# EasyEDA schematic EasyEDA SCHEMATIC.json
TITLE: ESCC Interceptor - first schematic; REV: 0.1; Date: 2024-01-13; Sheet: 1/1; Drawn By: devtekve; Company: sunnypilot
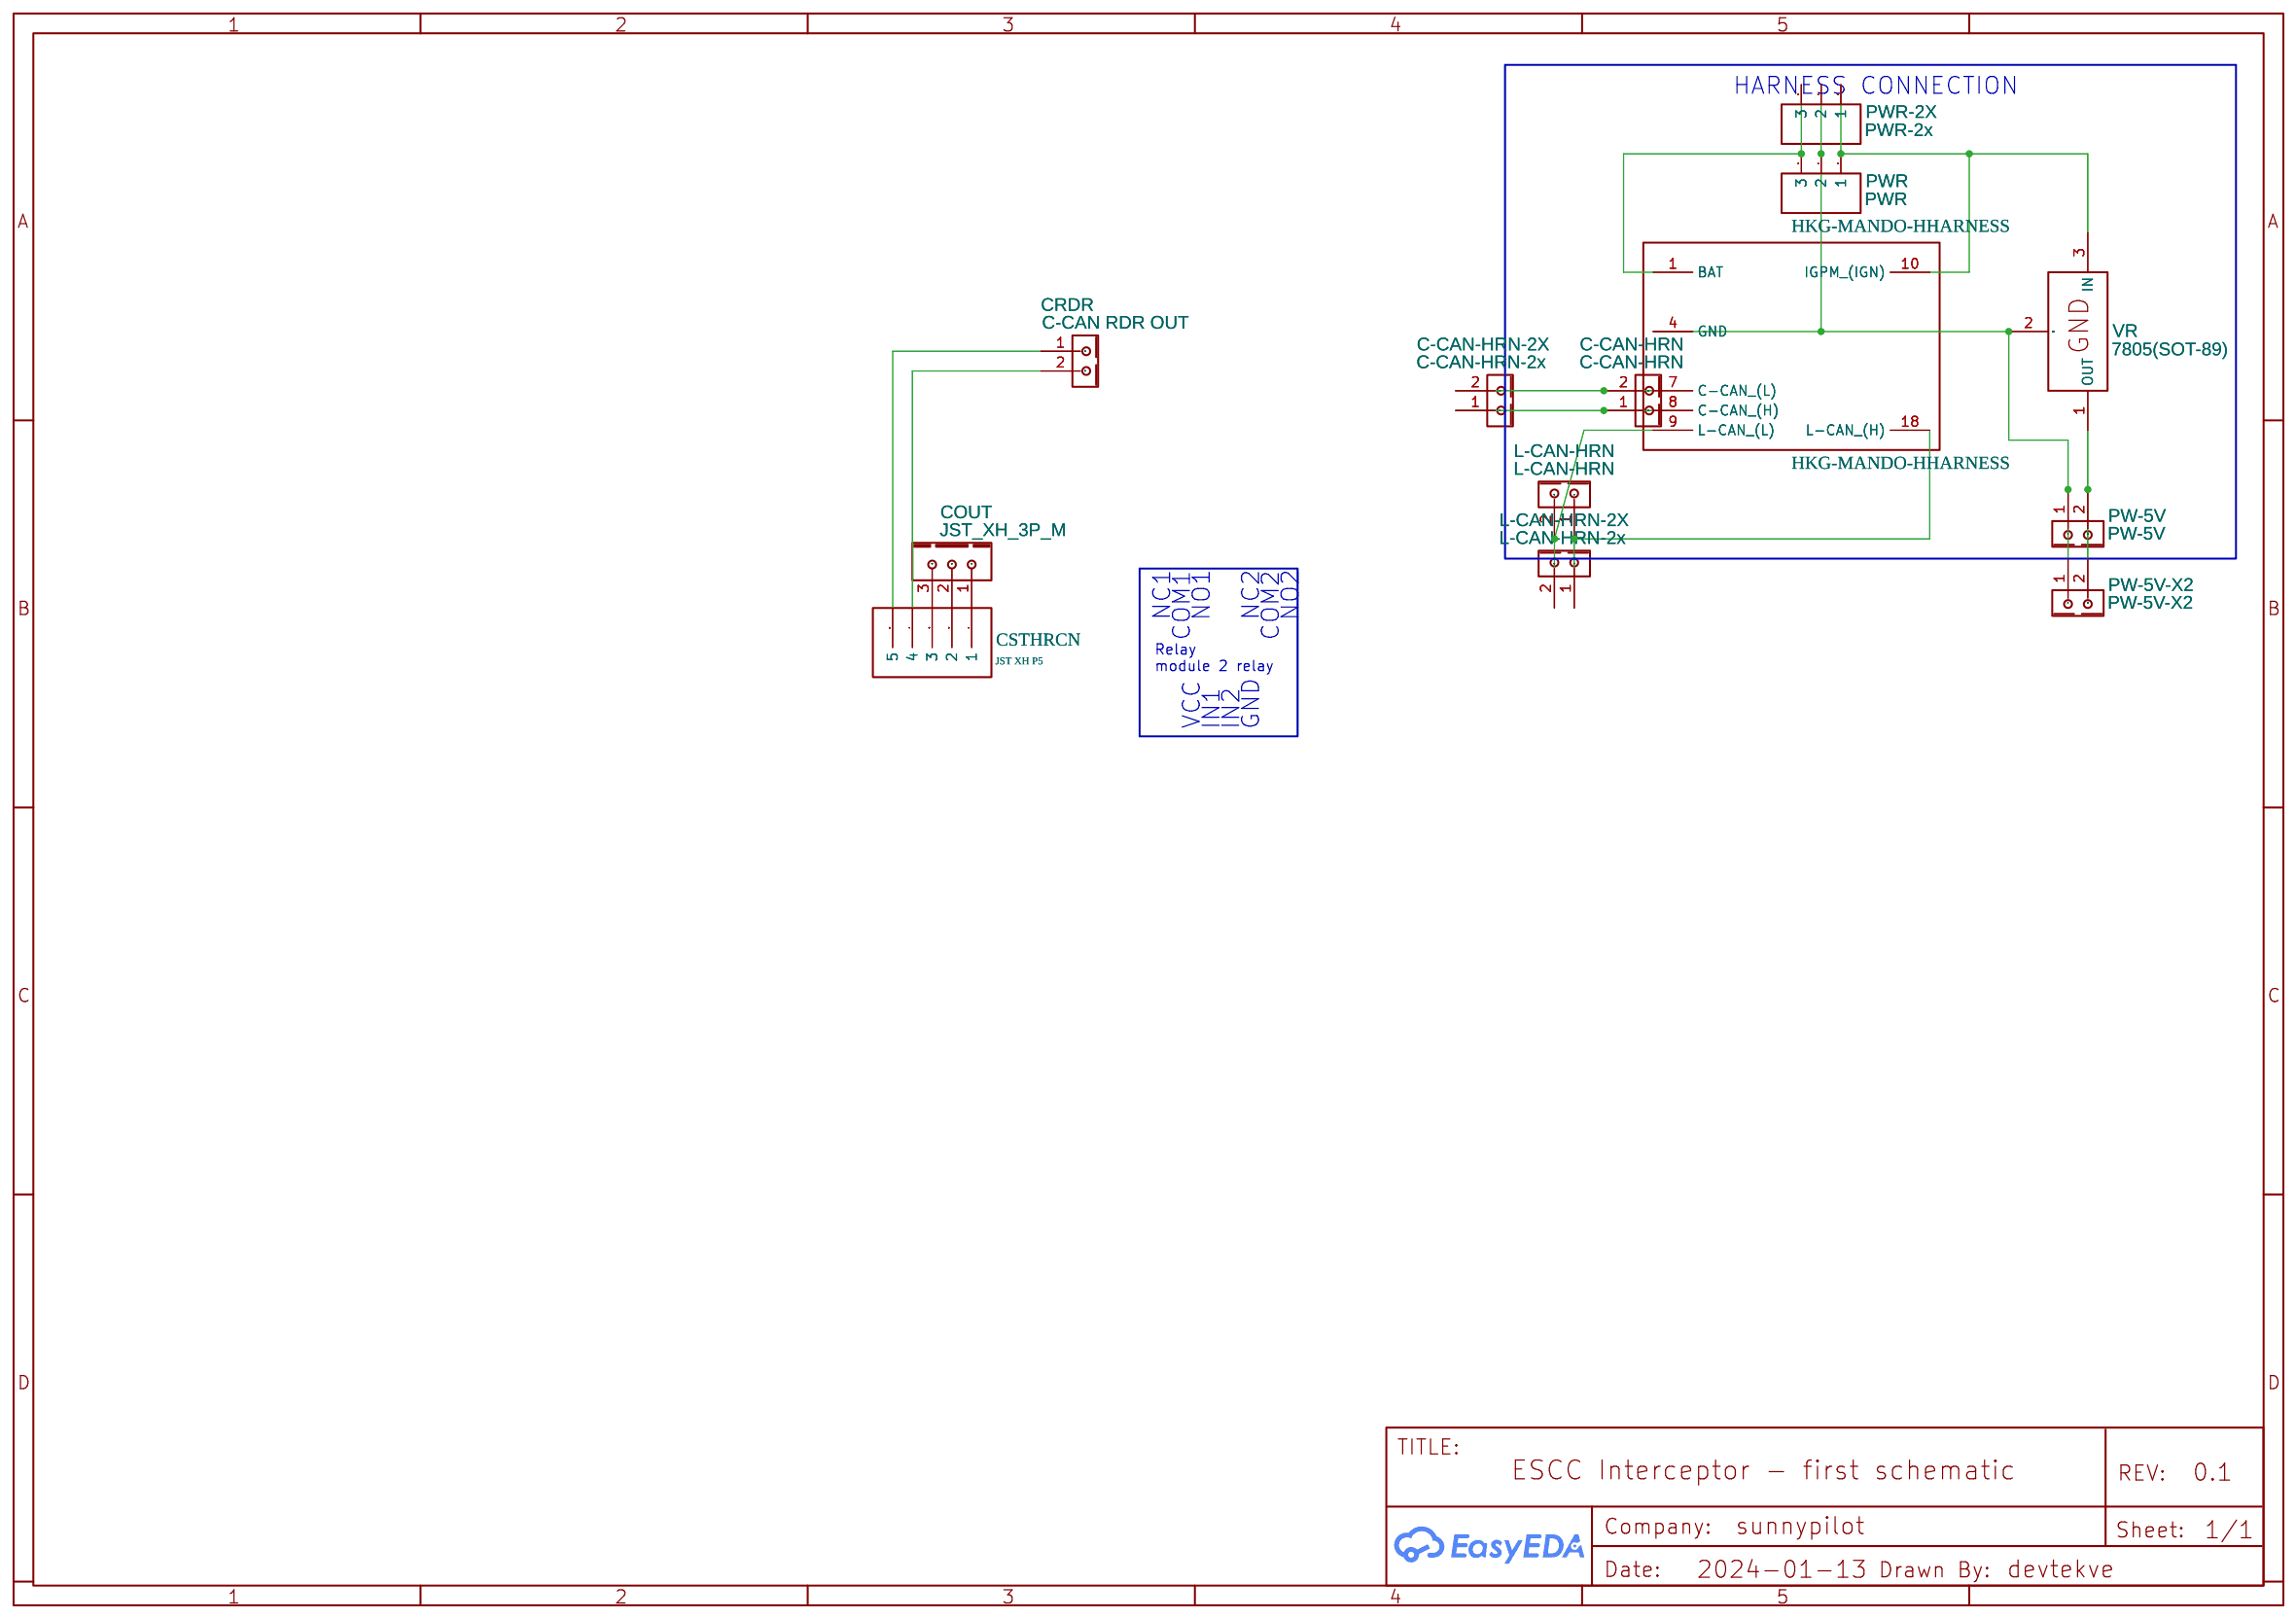
[diagram p0: schematic sheet]

## Parts
C-CAN-HRN  C-CAN-HRN  [JST_XH_2P_M]
C-CAN-HRN-2X  C-CAN-HRN-2x  [JST_XH_2P_M]
COUT  JST_XH_3P_M  [JST_XH_3P_M]
CRDR  C-CAN RDR OUT  [JST_XH_2P_M]
CSTHRCN  JST XH P5  [JST-XH-05-PACKAGE-LONG-PAD]
HKG-MANDO-HHARNESS  HKG-MANDO-HHARNESS  [HKG-MANDO-RECEPTACLE-L-SHAPE-TOP]
L-CAN-HRN  L-CAN-HRN  [JST_XH_2P_M]
L-CAN-HRN-2X  L-CAN-HRN-2x  [JST_XH_2P_M]
PW-5V  PW-5V  [JST_XH_2P_M]
PW-5V-X2  PW-5V-X2  [JST_XH_2P_M]
PWR  PWR  [JST-XH-3R]
PWR-2X  PWR-2x  [JST-XH-3R]
VR  7805(SOT-89)  [SOT-89-3_L4.5-W2.5-P1.50-LS4.2-BR]

## Library data of the parts
C-CAN-HRN C-CAN-HRN-2X CRDR L-CAN-HRN L-CAN-HRN-2X PW-5V PW-5V-X2 = JST_XH_2P_M: catid: 20; Contributor: thebigoldone; Supplier: Amazon; sim: true
COUT = JST_XH_3P_M: catid: 20; Contributor: thebigoldone; sim: true
PWR PWR-2X = -: Supplier: LCSC; Manufacturer: BOOMELE; Manufacturer Part: Header2.54mm 1*3P; image: //image.lceda.cn/szlcsc/C49257.jpg; Supplier Part: C49257
VR = 7805(SOT-89): Supplier: LCSC; Manufacturer: CJ; Manufacturer Part: CJ78L05; image: //image.lceda.cn/szlcsc/C2079.jpg; Supplier Part: C2079; Paste Type: expand; Contributor: LCEDA_Lib

## Nets
Net-(C-CAN-HRN-1): C-CAN-HRN.1 C-CAN-HRN-2X.1 HKG-MANDO-HHARNESS.8(C-CAN (H))
Net-(C-CAN-HRN-2): C-CAN-HRN.2 C-CAN-HRN-2X.2 HKG-MANDO-HHARNESS.7(C-CAN (L))
Net-(COUT-1): COUT.1 CSTHRCN.1
Net-(COUT-2): COUT.2 CSTHRCN.2
Net-(COUT-3): COUT.3 CSTHRCN.3
Net-(CRDR-1): CRDR.1 CSTHRCN.5
Net-(CRDR-2): CRDR.2 CSTHRCN.4
Net-(HKG-MANDO-HHARNESS-1): HKG-MANDO-HHARNESS.1(BAT) PWR.3 PWR-2X.3
Net-(HKG-MANDO-HHARNESS-4): HKG-MANDO-HHARNESS.4(GND) PW-5V.1 PW-5V-X2.1 PWR.2 PWR-2X.2 VR.2(GND)
Net-(HKG-MANDO-HHARNESS-9): HKG-MANDO-HHARNESS.9(L-CAN (L)) L-CAN-HRN.2 L-CAN-HRN-2X.2
Net-(HKG-MANDO-HHARNESS-10): HKG-MANDO-HHARNESS.10(IGPM (IGN)) PWR.1 PWR-2X.1 VR.3(IN)
Net-(HKG-MANDO-HHARNESS-18): HKG-MANDO-HHARNESS.18(L-CAN (H)) L-CAN-HRN.1 L-CAN-HRN-2X.1
Net-(PW-5V-2): PW-5V.2 PW-5V-X2.2 VR.1(OUT)

## Notes on the sheet
- HARNESS CONNECTION
- NC1
- NO1
- NC2
- NO2
- Relay
  module 2 relay
- COM1
- COM2
- VCC
- IN1
- IN2
- GND
